# Altium schematic sheet GTR_crossover.schdoc
size A4; CompanyName: Technische Hochschule Nürnberg Georg Simon Ohm; Organization: UltraZohm; Address1: Kesslerplatz 12; Address2: 90489 Nürnberg; Address3: GERMANY; SheetNumber: 35; SheetTotal: 36; Website: www.ultrazohm.com
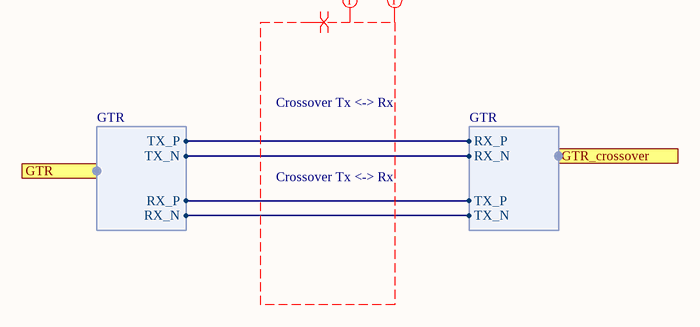
[diagram p0: GTR_crossover.schdoc]

## Ports
GTR (harness GTR), GTR_crossover (harness GTR)

## Harnesses
GTR: RX_N, RX_P, TX_N, TX_P

## Nets
(unnamed): port GTR.RX_N, port GTR_crossover.TX_N
(unnamed): port GTR.RX_P, port GTR_crossover.TX_P
(unnamed): port GTR.TX_N, port GTR_crossover.RX_N
(unnamed): port GTR.TX_P, port GTR_crossover.RX_P

## Layout directives
differential pair: (no net found under the mark)
net class HS: (no net found under the mark)
net class SATA: (no net found under the mark)

## Notes on the sheet
- Crossover Tx <-> Rx
- Title
- Revision:
- Design Engineer:
- Date:
- Project:
- Sheet
- of